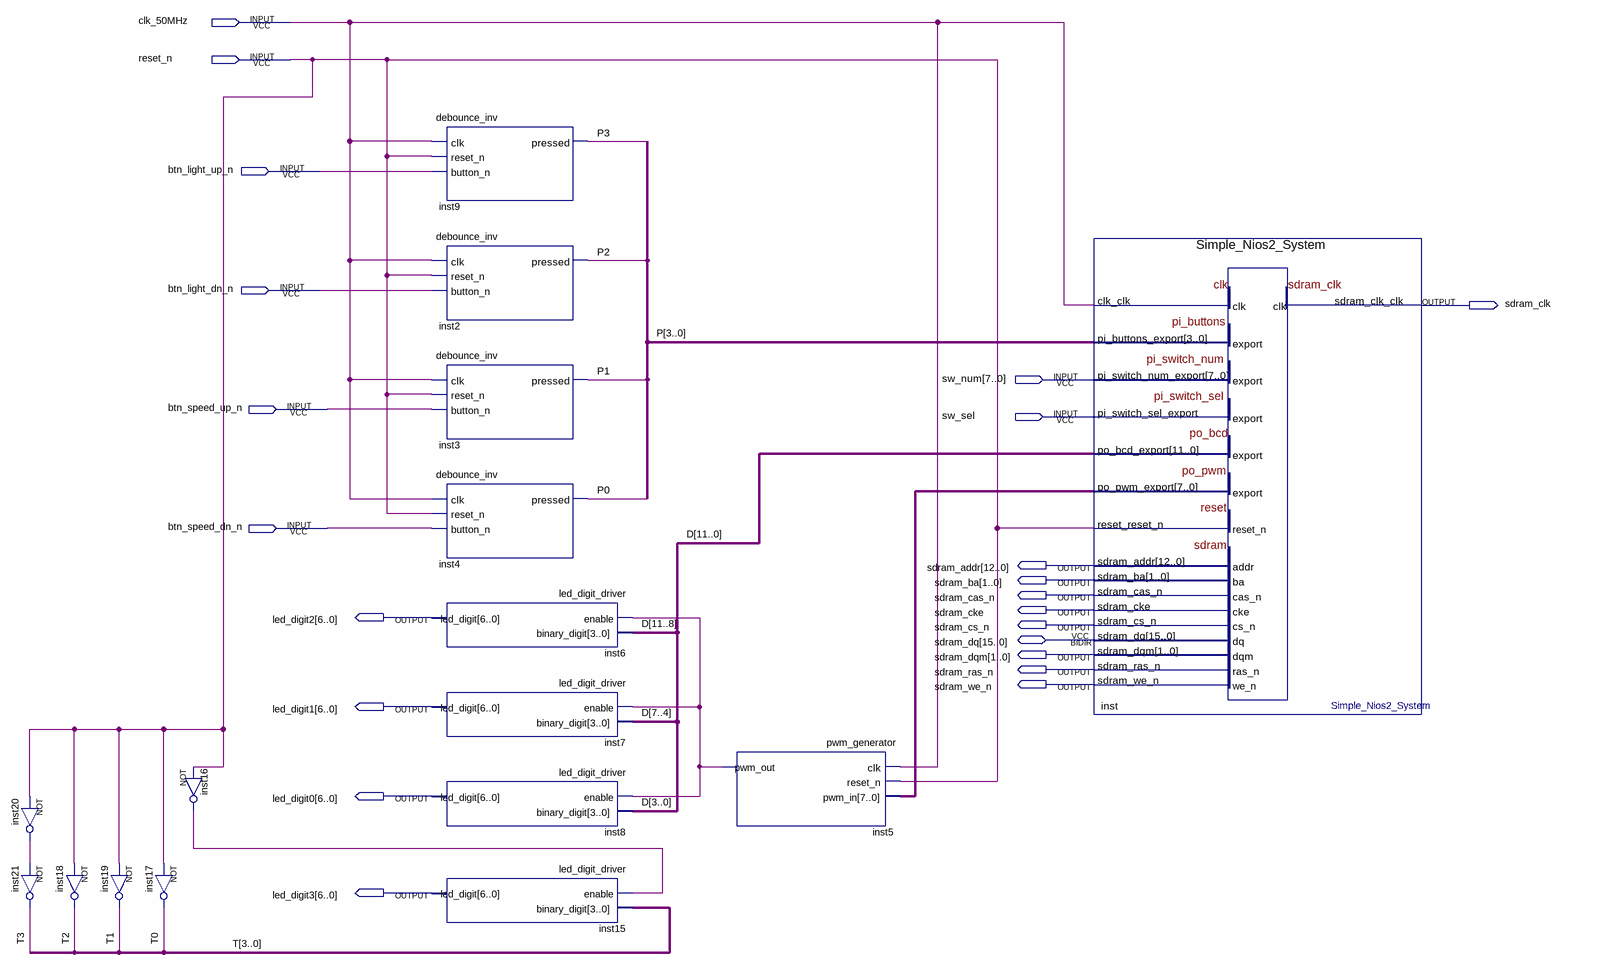
[diagram p0: schematic sheet]
// Quartus schematic basic_qsys_project.bdf as structural Verilog: 16 symbols, 22 pins
module basic_qsys_project (
  input  clk_50MHz,
  input  reset_n,
  input  btn_light_up_n,
  input  btn_light_dn_n,
  input  [7:0] sw_num,
  input  btn_speed_up_n,
  input  sw_sel,
  input  btn_speed_dn_n,
  inout  [15:0] sdram_dq,
  output sdram_clk,
  output [12:0] sdram_addr,
  output [1:0] sdram_ba,
  output sdram_cas_n,
  output sdram_cke,
  output [6:0] led_digit2,
  output sdram_cs_n,
  output [1:0] sdram_dqm,
  output sdram_ras_n,
  output sdram_we_n,
  output [6:0] led_digit1,
  output [6:0] led_digit0,
  output [6:0] led_digit3
);

  wire inst5_pwm_out, inst16_out, inst20_out;
  wire [3:0] P, T;
  wire [7:0] inst_po_pwm_export;
  wire [11:0] D;

  not inst20 (inst20_out, reset_n);
  not inst21 (T[3], inst20_out);
  not inst18 (T[2], reset_n);
  not inst17 (T[0], reset_n);
  not inst19 (T[1], reset_n);
  not inst16 (inst16_out, reset_n);
  debounce_inv inst9 (.clk(clk_50MHz), .reset_n(reset_n), .button_n(btn_light_up_n), .pressed(P[3]));
  debounce_inv inst2 (.clk(clk_50MHz), .reset_n(reset_n), .button_n(btn_light_dn_n), .pressed(P[2]));
  debounce_inv inst3 (.clk(clk_50MHz), .reset_n(reset_n), .button_n(btn_speed_up_n), .pressed(P[1]));
  debounce_inv inst4 (.clk(clk_50MHz), .reset_n(reset_n), .button_n(btn_speed_dn_n), .pressed(P[0]));
  led_digit_driver inst6 (.enable(inst5_pwm_out), .binary_digit(D[11:8]), .led_digit(led_digit2));
  led_digit_driver inst7 (.enable(inst5_pwm_out), .binary_digit(D[7:4]), .led_digit(led_digit1));
  led_digit_driver inst8 (.enable(inst5_pwm_out), .binary_digit(D[3:0]), .led_digit(led_digit0));
  led_digit_driver inst15 (.enable(inst16_out), .binary_digit(T), .led_digit(led_digit3));
  pwm_generator inst5 (.clk(clk_50MHz), .reset_n(reset_n), .pwm_in(inst_po_pwm_export), .pwm_out(inst5_pwm_out));
  Simple_Nios2_System inst (
    .clk_clk(clk_50MHz), .pi_buttons_export(P), .pi_switch_num_export(sw_num), .pi_switch_sel_export(sw_sel),
    .reset_reset_n(reset_n), .po_bcd_export(D), .po_pwm_export(inst_po_pwm_export), .sdram_addr(sdram_addr),
    .sdram_ba(sdram_ba), .sdram_cas_n(sdram_cas_n), .sdram_cke(sdram_cke), .sdram_cs_n(sdram_cs_n),
    .sdram_dqm(sdram_dqm), .sdram_ras_n(sdram_ras_n), .sdram_we_n(sdram_we_n), .sdram_clk_clk(sdram_clk),
    .sdram_dq(sdram_dq));
endmodule
